# Altium schematic sheet Communication.SchDoc
size A4
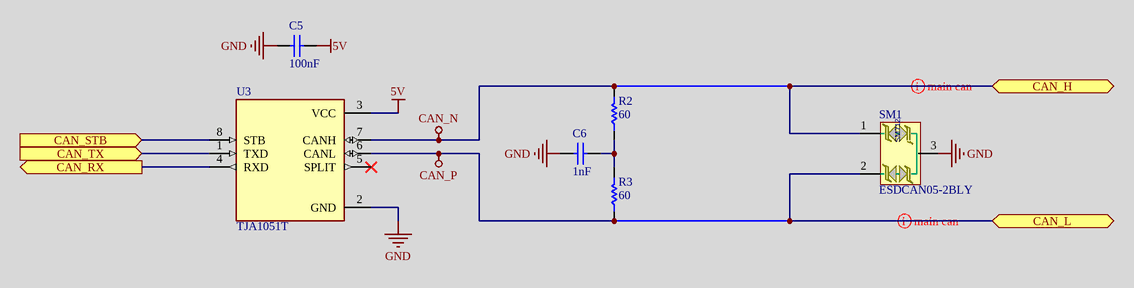
[diagram p0: Communication.SchDoc]

## Parts
C5  100nF  [CAPC0603]
C6  1nF  [CAPC0603]
R2  60  [RESC0603]
R3  60  [RESC0603]
SM1  ESDCAN05-2BLY  [SOT-23_N]
U3  TJA1051T  [LM358]

## Ports
CAN_H (bidir), CAN_L (bidir), CAN_RX (out), CAN_STB (in), CAN_TX (in)

## Nets
5V: C5.1 U3.3(VCC)
CAN_N: R2.2 SM1.1 U3.7(CANH) ; port CAN_H
CAN_P: R3.1 SM1.2 U3.6(CANL) ; port CAN_L
GND: C5.2 C6.2 SM1.3 U3.2(GND)
CAN_RX: U3.4(RXD) ; port CAN_RX
CAN_STB: U3.8(STB) ; port CAN_STB
CAN_TX: U3.1(TXD) ; port CAN_TX
NetC6_1: C6.1 R2.1 R3.2

Not connected (* = marked no-connect by the designer): U3 5(SPLIT)*

## Layout directives
differential pair: CAN_N, CAN_P

## Library data of the parts
C5 C6 = Cap: Capacitor; Published: 8-Jun-2000; LatestRevisionDate: 17-Jul-2002; LatestRevisionNote: Re-released for DXP Platform.; PackageReference: RAD-0.3; Publisher: Altium Limited; PackageDescription: Radial Cap, Thru-Hole; 2 Leads; 0.3 in Pin Spacing
  C5: Value: 100nF
  C6: Value: 1nF
R2 R3 = Resistor: Tolerance: 5%; Power: 1/8 W; Value: 60
SM1 = SM712: Asymmetrical TVS Diode for Extended Common-Mode RS-485
U3 = TJA1040: 1/1 Transceiver Half CANbus 8-SO; MF: NXP USA; Package: SOIC-8 NXP USA; SnapEDA_Link: https://www.snapeda.com/parts/TJA1040/NXP%20USA%20Inc./view-part/563351/?ref=snap; Price: None; Availability: Unavailable; MP: TJA1040; Value: *